# Altium project CoolantMonitor.PrjPcb
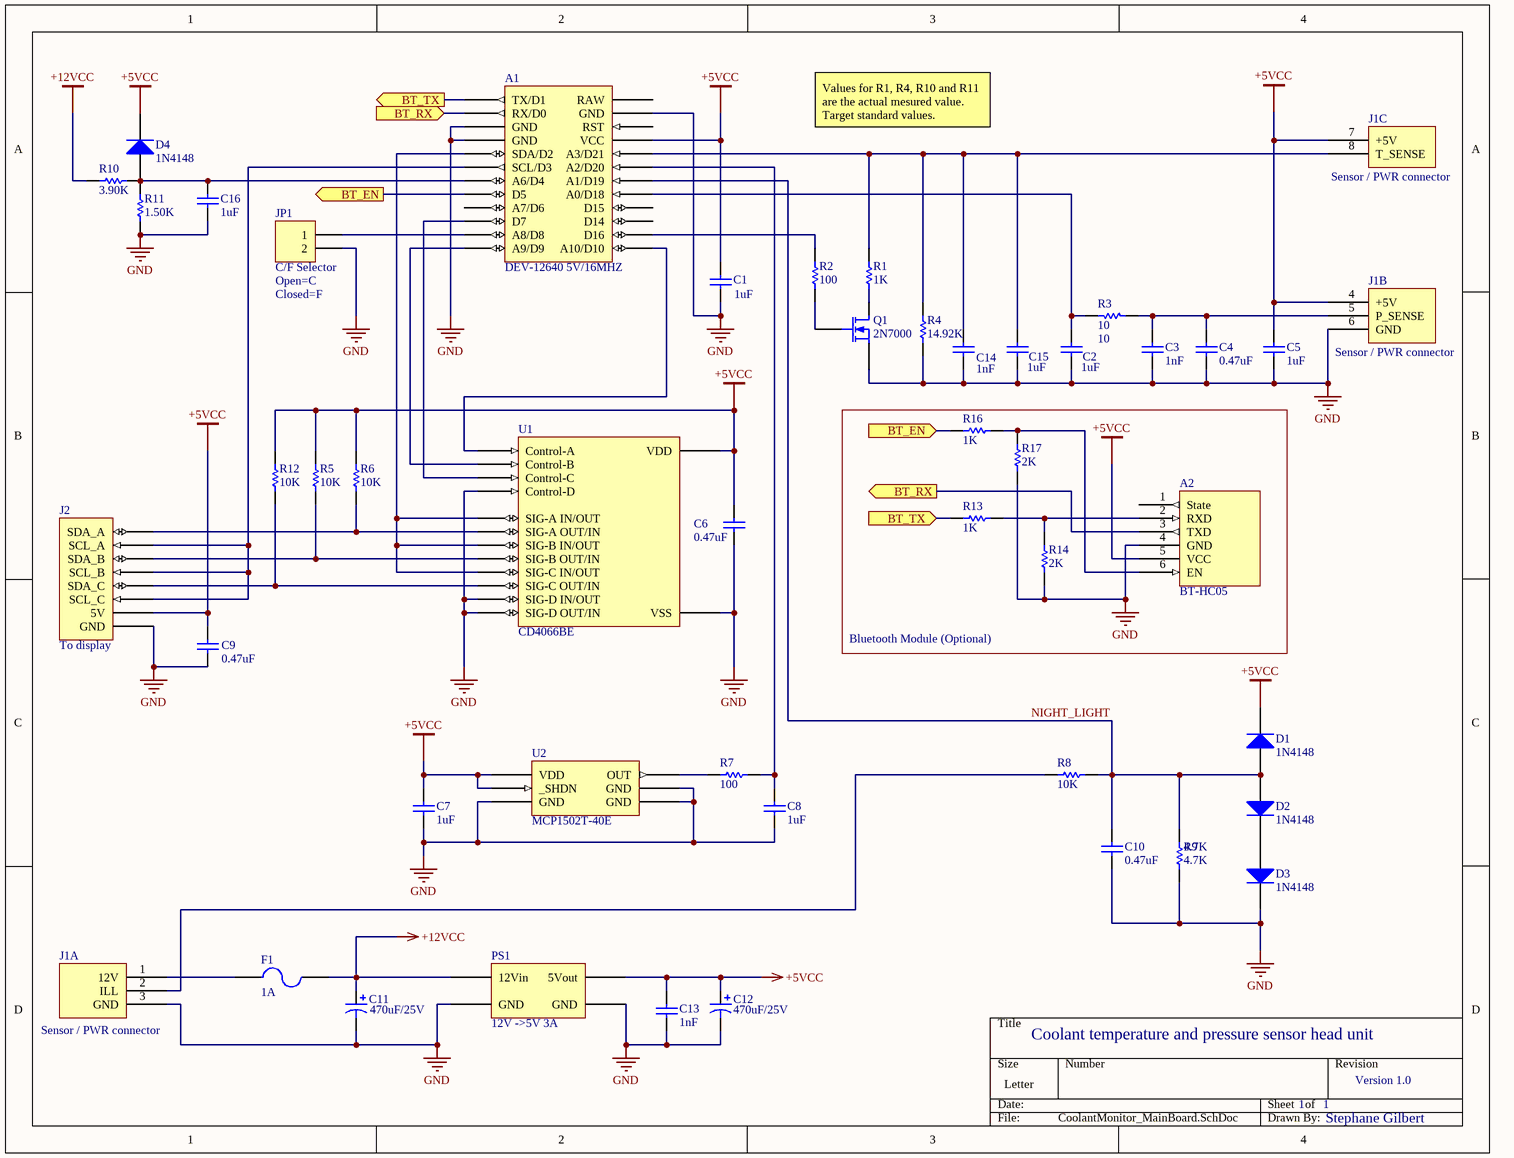
[diagram p0: CoolantMonitor_MainBoard.SchDoc]
2 sheets, 54 parts. Net scope: flat (ports and power ports of the same name join across sheets).
Board file: CoolantMonitor_MainBoard.PcbDoc
Sheets:
  CoolantMonitor_MainBoard.SchDoc
  CoolantMonitor_Interconnect.SchDoc

## Sheet CoolantMonitor_MainBoard.SchDoc
size Letter

### Parts
A1  DEV-12640 5V/16MHZ  [ProMicro]
A2  BT-HC05  [BT-HC05]
C1  1uF  [RAD_0.2_S]
C2  1uF  [RAD_0.2_S]
C3  1nF  [RAD_0.2_S]
C4  0.47uF  [RAD_0.2_S]
C5  1uF  [RAD_0.2_S]
C6  0.47uF  [RAD_0.2_S]
C7  1uF  [RAD_0.2_S]
C8  1uF  [RAD_0.2_S]
C9  0.47uF  [RAD_0.2_S]
C10  0.47uF  [RAD_0.2_S]
C11  470uF/25V  [RB_3.5MM]
C12  470uF/25V  [RB_3.5MM]
C13  1nF  [RAD_0.2_S]
C14  1nF  [RAD_0.2_S]
C15  1uF  [RAD_0.2_S]
C16  1uF  [RAD_0.2_S]
D1  1N4148  [DO-35A]
D2  1N4148  [DO-35A]
D3  1N4148  [DO-35A]
D4  1N4148  [DO-35A]
F1  1A  [AXIAL-0.4]
J1  Sensor / PWR connector  [MTA-100-8]  (parts A,B,C of 3)
J2  To display  [MOLEX_ULTRA_FIT_8_POS_RA]
JP1  C/F Selector  [HDR1X2]
PS1  12V ->5V 3A  [CPT_DC-DC]
Q1  2N7000  [TO-92A]
R1  value 1K  [AXIAL-0.4]  (hidden comment: Res1)
R2  100  [AXIAL-0.4]
R3  10  [AXIAL-0.4]
R4  14.92K  [AXIAL-0.4]
R5  10K  [AXIAL-0.4]
R6  10K  [AXIAL-0.4]
R7  100  [AXIAL-0.4]
R8  10K  [AXIAL-0.4]
R9  4.7K  [AXIAL-0.4]
R10  3.90K  [AXIAL-0.4]
R11  1.50K  [AXIAL-0.4]
R12  10K  [AXIAL-0.4]
R13  1K  [AXIAL-0.4]
R14  2K  [AXIAL-0.4]
R16  1K  [AXIAL-0.4]
R17  2K  [AXIAL-0.4]
U1  CD4066BE  [DIP-14]
U2  MCP1502T-40E  [SOT-6-S]

### Blocks framed on the sheet
Bluetooth Module (Optional): A2 R13 R14 R16 R17

### Ports
BT_EN (in), BT_EN (out), BT_RX (in), BT_RX (out), BT_TX (in), BT_TX (out)

### Nets
+5VCC: A1.21(VCC) A2.5(VCC) C1.2 C5.2 C6.2 C7.2 C9.2 C12.1 C13.2 D1.2(K) D4.2(K) J1.4(+5V) J1.7(+5V) J2.1(5V) PS1.3(5Vout) R5.2 R6.2 R12.2 U1.14(VDD) U2.4(_SHDN) U2.6(VDD)
+12VCC: C11.1 F1.2 PS1.2(12Vin) R10.1
GND: A1.3(GND) A1.4(GND) A1.23(GND) A2.4(GND) C1.1 C2.1 C3.1 C4.1 C5.1 C6.1 C7.1 C8.1 C9.1 C10.1 C11.2 C12.2 C13.1 C14.1 C15.1 C16.1 D3.2(K) J1.3(GND) J1.6(GND) J2.2(GND) JP1.2 PS1.1(GND) PS1.4(GND) Q1.3(S) R4.1 R9.1 R11.1 R14.2 R17.2 U1.7(VSS) U1.10(SIG-D_OUT/IN) U1.11(SIG-D_IN/OUT) U1.12(Control-D) U2.2(GND) U2.3(GND) U2.5(GND)
NIGHT_LIGHT: A1.18(A1/D19) C10.2 D1.1(A) D2.1(A) R8.2 R9.2
NetA1_1: A1.1(TX/D1) R13.2 ; port BT_TX
NetA1_2: A1.2(RX/D0) A2.3(TXD) ; port BT_RX
NetA1_5: A1.5(SDA/D2) U1.1(SIG-A_IN/OUT) U1.4(SIG-B_IN/OUT) U1.8(SIG-C_IN/OUT)
NetA1_6: A1.6(SCL/D3) J2.4(SCL_A) J2.6(SCL_B) J2.8(SCL_C)
NetA1_7: A1.7(A6/D4) C16.2 D4.1(A) R10.2 R11.2
NetA1_8: A1.8(D5) R16.2 ; port BT_EN
NetA1_10: A1.10(D7) U1.6(Control-C)
NetA1_11: A1.11(A8/D8) JP1.1
NetA1_12: A1.12(A9/D9) U1.5(Control-B)
NetA1_13: A1.13(A10/D10) U1.13(Control-A)
NetA1_14: A1.14(D16) R2.2
NetA1_17: A1.17(A0/D18) C2.2 R3.2
NetA1_19: A1.19(A2/D20) C8.2 R7.2
NetA1_20: A1.20(A3/D21) C14.2 C15.2 J1.8(T_SENSE) R1.2 R4.2
NetA2_2: A2.2(RXD) R13.1 R14.1
NetA2_6: A2.6(EN) R16.1 R17.1
NetC3_2: C3.2 C4.2 J1.5(P_SENSE) R3.1
NetD2_2: D2.2(K) D3.1(A)
NetF1_1: F1.1 J1.1(12V)
NetJ1_2: J1.2(ILL) R8.1
NetJ2_3: J2.3(SDA_A) R6.1 U1.2(SIG-A_OUT/IN)
NetJ2_5: J2.5(SDA_B) R5.1 U1.3(SIG-B_OUT/IN)
NetJ2_7: J2.7(SDA_C) R12.1 U1.9(SIG-C_OUT/IN)
NetQ1_1: Q1.1(D) R1.1
NetQ1_2: Q1.2(G) R2.1
NetR7_1: R7.1 U2.1(OUT)

Not connected (* = marked no-connect by the designer): A1 9(A7/D6) 15(D14) 16(D15) 22(RST) 24(RAW); A2 1(State)

### Notes on the sheet
- Values for R1, R4, R10 and R11 are the actual mesured value. Target standard values.
- (near JP1) Closed=F
- (near JP1) Open=C
- Coolant temperature and pressure sensor head unit
- 1
- Version 1.0
- Stephane Gilbert

### Library data of the parts
A1 = ProMicro: Arduino MCU; Manufacturer: Sparkfun; Value: Pro Micro 32U4 5V/16MHZ; Part #: DEV-12640
A2 = BT-HC05: Bluetooth module; Manufacturer: Many; Value: HC-05; Part #: HC-05
C1 C2 C5 C7 C8 C15 C16 = Cap: Capacitor; Manufacturer: TDK; Part #: FG28X7R1E105KRT06; Published: 8-Jun-2000; LatestRevisionDate: 17-Jul-2002; LatestRevisionNote: Re-released for DXP Platform.; PackageReference: RAD-0.3; Publisher: Altium Limited; PackageDescription: Radial Cap, Thru-Hole; 2 Leads; 0.3 in Pin Spacing; Value: 1uF; Digikey: 445-173583-1-ND
C3 C13 C14 = Cap: Capacitor; Manufacturer: Kemet; Part #: C315C102J3H5TA9170; Published: 8-Jun-2000; LatestRevisionDate: 17-Jul-2002; LatestRevisionNote: Re-released for DXP Platform.; PackageReference: RAD-0.3; Publisher: Altium Limited; PackageDescription: Radial Cap, Thru-Hole; 2 Leads; 0.3 in Pin Spacing; Value: 1nF; Digikey: 399-17274-ND
C4 C6 C9 C10 = Cap: Capacitor; Manufacturer: TDK; Part #: FA24X7R1E474KNU06; Published: 8-Jun-2000; LatestRevisionDate: 17-Jul-2002; LatestRevisionNote: Re-released for DXP Platform.; PackageReference: RAD-0.3; Publisher: Altium Limited; PackageDescription: Radial Cap, Thru-Hole; 2 Leads; 0.3 in Pin Spacing; Value: 0.47uF; Digikey: 445-180634-1-ND
C11 C12 = Cap Pol1: Polarized Capacitor (Radial); Manufacturer: Vishay; Part #: MAL214656471E3; Published: 8-Jun-2000; LatestRevisionDate: 17-Jul-2002; LatestRevisionNote: Re-released for DXP Platform.; PackageReference: RB7.6-15; Publisher: Altium Limited; PackageDescription: Polarized Capacitor (Radial); 2 Leads; Value: 470uF/25V; Digikey: 4473PHBK-ND
D1-D4 = Diode 1N4148: High Conductance Fast Diode; Manufacturer: Onsemi; Published: 8-Jun-2000; LatestRevisionDate: 17-Jul-2002; LatestRevisionNote: Re-released for DXP Platform.; DatasheetVersion: 1997; PackageReference: DO-35; Publisher: Altium Limited; PackageDescription: Diode, Axial; Body 3.8 x 1.9 mm (LxDia. max), Lead Dia. 0.53 mm (max); Code_JEDEC: DO-204-AH; ComponentLink1Description: Manufacturer Link; ComponentLink1URL: http://www.fairchildsemi.com/; ComponentLink2Description: Datasheet; ComponentLink2URL: http://www.fairchildsemi.com/ds/1N%2F1N4148.pdf; Digikey: 1N4148FS-ND; Value: 1N4148; Part #: 1N4148
F1 = Fuse 2: Fuse; Manufacturer: Littlefuse; Part #: 0251.500NRT1L; Published: 8-Jun-2000; LatestRevisionDate: 17-Jul-2002; LatestRevisionNote: Re-released for DXP Platform.; PackageReference: PIN-W2/E2.8; Publisher: Altium Limited; PackageDescription: Thru-Hole; 2 Leads; Digikey: F5998CT-ND; Value: 1A
J1 = SENS_INTERFACE_RX8: 8 Pins connector; Manufacturer: Molex; Part #: 1723162108; Value: Molex 1723162108; Digikey: WM11868-ND
J2 = TRIPLE_DISPLAY_RX8: 8 Pins connector; Manufacturer: Molex; Part #: 1723162108; Value: Molex 1723162108; Digikey: WM11868-ND
JP1 = Header 2: Header, 2-Pin; Value: Jumper; LatestRevisionDate: 17-Jul-2002; LatestRevisionNote: Re-released for DXP Platform.; Publisher: Altium Limited
PS1 = CPT_DC-DC: CPT DC-DC 12V/5V 3A; Manufacturer: Car Power Technology; Value: 12V->5V DC-DC
Q1 = MOSFET-N: N-Channel MOSFET; pin to pad: 1>3 3>1; Manufacturer: STMicroelectronics; Published: 8-Jun-2000; LatestRevisionDate: 17-Jul-2002; LatestRevisionNote: Re-released for DXP Platform.; PackageVersion: 1995/1996; PackageReference: E3; Publisher: Altium Limited; PackageDescription: TO, Flat Index; 3 In-Line, Axial Leads; Body Dia. 4.6mm; Lead Dia. 0.5 mm (max); Value: 2N7000; Digikey: 497-3110-ND; Part #: 2N7000
R1 R13 R16 = Res1: Resistor; Manufacturer: Stackpole Electronics Inc; Part #: CF18JT1K00; Published: 8-Jun-2000; LatestRevisionDate: 17-Jul-2002; LatestRevisionNote: Re-released for DXP Platform.; PackageReference: AXIAL-0.3; Publisher: Altium Limited; PackageDescription: Axial Device, Thru-Hole; 2 Leads; 0.3 in Pin Spacing; Digikey: CF18JT1K00CT-ND
  R13 R16: Value: 1K
R2 R7 = Res1: Resistor; Manufacturer: Stackpole Electronics Inc; Part #: CF18JT100R; Published: 8-Jun-2000; LatestRevisionDate: 17-Jul-2002; LatestRevisionNote: Re-released for DXP Platform.; PackageReference: AXIAL-0.3; Publisher: Altium Limited; PackageDescription: Axial Device, Thru-Hole; 2 Leads; 0.3 in Pin Spacing; Value: 100; Digikey: CF18JT100RCT-ND
R3 = Res1: Resistor; Manufacturer: Stackpole Electronics Inc; Part #: CF18JT10R0; Published: 8-Jun-2000; LatestRevisionDate: 17-Jul-2002; LatestRevisionNote: Re-released for DXP Platform.; PackageReference: AXIAL-0.3; Publisher: Altium Limited; PackageDescription: Axial Device, Thru-Hole; 2 Leads; 0.3 in Pin Spacing; Value: 10; Digikey: CF18JT10R0CT-ND
R4 = Res1: Resistor; Manufacturer: Stackpole Electronics Inc; Part #: CF18JT15K0; Published: 8-Jun-2000; LatestRevisionDate: 17-Jul-2002; LatestRevisionNote: Re-released for DXP Platform.; PackageReference: AXIAL-0.3; Publisher: Altium Limited; PackageDescription: Axial Device, Thru-Hole; 2 Leads; 0.3 in Pin Spacing; Value: 14.92K; Digikey: CF18JT15K0CT-ND
R5 R6 R8 R12 = Res1: Resistor; Manufacturer: Stackpole Electronics Inc; Part #: CF18JT10K0; Published: 8-Jun-2000; LatestRevisionDate: 17-Jul-2002; LatestRevisionNote: Re-released for DXP Platform.; PackageReference: AXIAL-0.3; Publisher: Altium Limited; PackageDescription: Axial Device, Thru-Hole; 2 Leads; 0.3 in Pin Spacing; Value: 10K; Digikey: CF18JT10K0CT-ND
R9 = Res1: Resistor; Manufacturer: Stackpole Electronics Inc; Part #: CF18JT4K70; Published: 8-Jun-2000; LatestRevisionDate: 17-Jul-2002; LatestRevisionNote: Re-released for DXP Platform.; PackageReference: AXIAL-0.3; Publisher: Altium Limited; PackageDescription: Axial Device, Thru-Hole; 2 Leads; 0.3 in Pin Spacing; Value: 4.7K; Digikey: CF18JT4K70CT-ND
R10 = Res1: Resistor; Manufacturer: Stackpole Electronics Inc; Part #: CF18JT3K90; Published: 8-Jun-2000; LatestRevisionDate: 17-Jul-2002; LatestRevisionNote: Re-released for DXP Platform.; PackageReference: AXIAL-0.3; Publisher: Altium Limited; PackageDescription: Axial Device, Thru-Hole; 2 Leads; 0.3 in Pin Spacing; Value: 3.90K; Digikey: CF18JT3K90CT-ND
R11 = Res1: Resistor; Manufacturer: Stackpole Electronics Inc; Part #: CF18JT1K50; Published: 8-Jun-2000; LatestRevisionDate: 17-Jul-2002; LatestRevisionNote: Re-released for DXP Platform.; PackageReference: AXIAL-0.3; Publisher: Altium Limited; PackageDescription: Axial Device, Thru-Hole; 2 Leads; 0.3 in Pin Spacing; Value: 1.50K; Digikey: CF18JT1K50CT-ND
R14 R17 = Res1: Resistor; Manufacturer: Stackpole Electronics Inc; Part #: CF18JT2K00; Published: 8-Jun-2000; LatestRevisionDate: 17-Jul-2002; LatestRevisionNote: Re-released for DXP Platform.; PackageReference: AXIAL-0.3; Publisher: Altium Limited; PackageDescription: Axial Device, Thru-Hole; 2 Leads; 0.3 in Pin Spacing; Value: 2K; Digikey: CF18JT2K00CT-ND
U1 = CD4066BE: Quad bilateral switch; Manufacturer: TI; Digikey: 296-2061-5-ND; Value: CD4066BE; Part #: CD4066BE
U2 = MCP1502: Voltage reference; Manufacturer: Michochip; Value: MCP1502T-40E/CHY; Digikey: 150-MCP1502T-40E/CHYCT-ND; Part #: MCP1502T-40E/CHY

## Sheet CoolantMonitor_Interconnect.SchDoc
size A
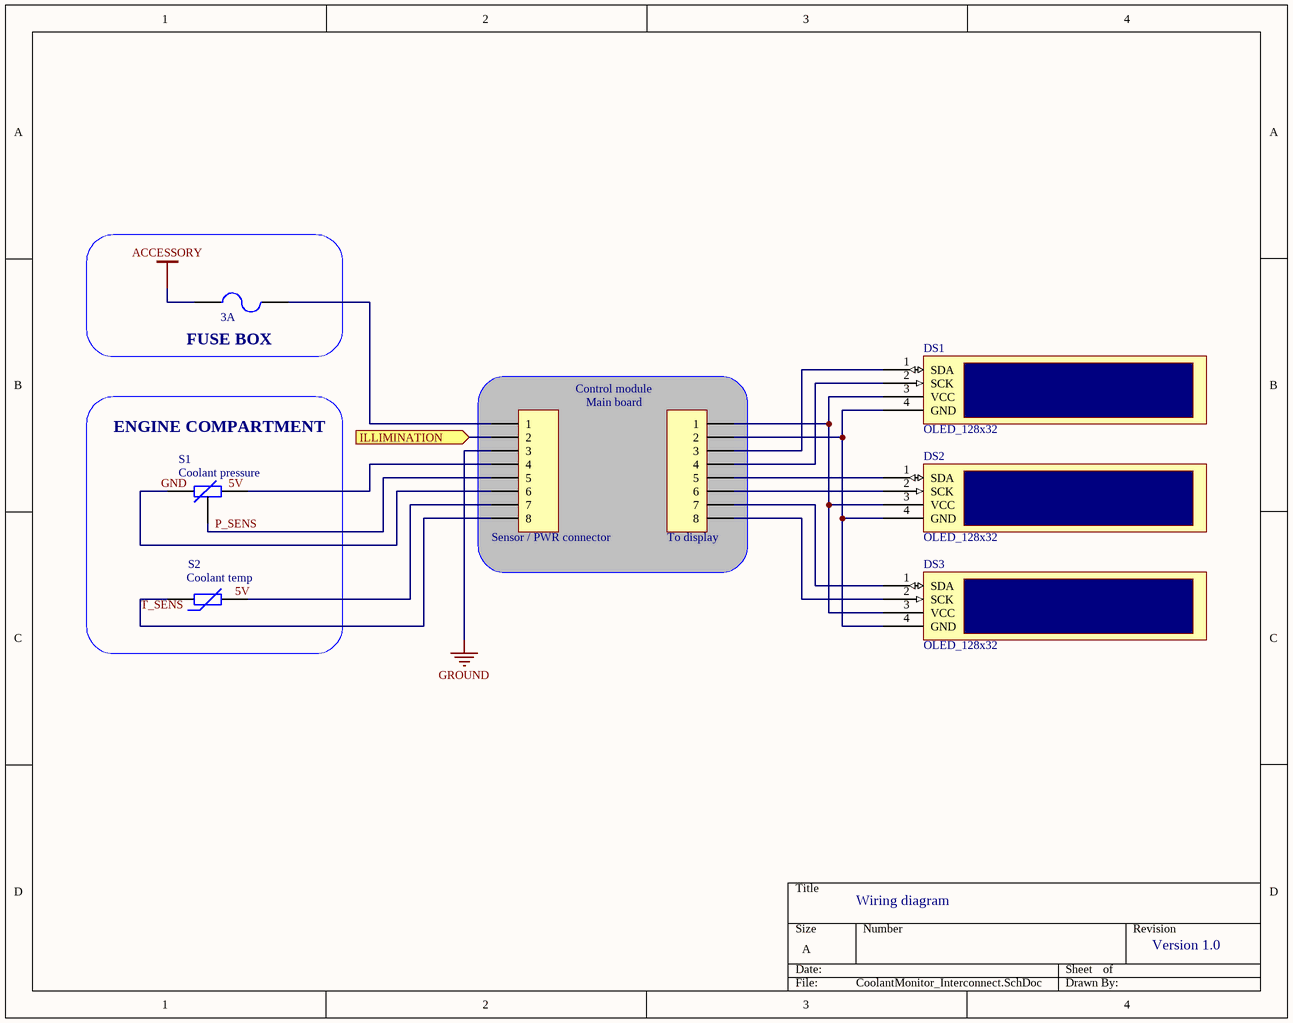
[diagram p1: CoolantMonitor_Interconnect.SchDoc]

### Parts
(Parts that share a designator on the sheet are numbered #1, #2 ... from top to bottom, then left to right.)
?#1  3A  [PIN-W2/E2.8]
?#2  Sensor / PWR connector  [HDR1X8]
?#3  To display  [HDR1X8]
DS1  OLED_128x32
DS2  OLED_128x32
DS3  OLED_128x32
S1  Coolant pressure
S2  Coolant temp  [6-0805_L]

### Blocks framed on the sheet
FUSE BOX: ?#1
ENGINE COMPARTMENT: S1 S2

### Ports
ILLIMINATION (in)

### Nets
ACCESSORY: ?#1.1
GROUND: ?#2.3
GND: ?#2.6 S1.2
P_SENS: ?#2.5
T_SENS: ?#2.8 S2.1
Net?#1_2: ?#1.2 ?#2.1
Net?#2_2: ?#2.2 ; port ILLIMINATION
Net?#2_4: ?#2.4 S1.1
Net?#2_7: ?#2.7 S2.2
Net?#3_1: ?#3.1 DS1.3(VCC) DS2.3(VCC) DS3.3(VCC)
Net?#3_2: ?#3.2 DS1.4(GND) DS2.4(GND) DS3.4(GND)
Net?#3_3: ?#3.3 DS1.1(SDA)
Net?#3_4: ?#3.4 DS1.2(SCK)
Net?#3_5: ?#3.5 DS2.1(SDA)
Net?#3_6: ?#3.6 DS2.2(SCK)
Net?#3_7: ?#3.7 DS3.1(SDA)
Net?#3_8: ?#3.8 DS3.2(SCK)

Not connected (* = marked no-connect by the designer): S1 3

### Notes on the sheet
- Control module
- Main board
- Wiring diagram
- Version 1.0
- Labels drawn without touching a wire or pin: 5V

### Library data of the parts
?#1 = Fuse 2: Fuse; Published: 8-Jun-2000; LatestRevisionDate: 17-Jul-2002; LatestRevisionNote: Re-released for DXP Platform.; PackageReference: PIN-W2/E2.8; Publisher: Altium Limited; PackageDescription: Thru-Hole; 2 Leads
?#2 ?#3 = Header 8: Header, 8-Pin; LatestRevisionDate: 17-Jul-2002; LatestRevisionNote: Re-released for DXP Platform.; Publisher: Altium Limited
S1 = TEMP_SENSOR
S2 = Res Varistor: Varistor (Voltage-Sensitive Resistor); Published: 24-Mar-1999; LatestRevisionDate: 29-May-2009; LatestRevisionNote: IPC-7351 Footprint Added.; PackageVersion: Mar-2003; PackageReference: 6-0805; Publisher: Altium Limited; PackageDescription: Chip Resistor 0805 Case Size; Code_IPC: RESC2012